# EAGLE design P32 Main (EAGLE 5.06)
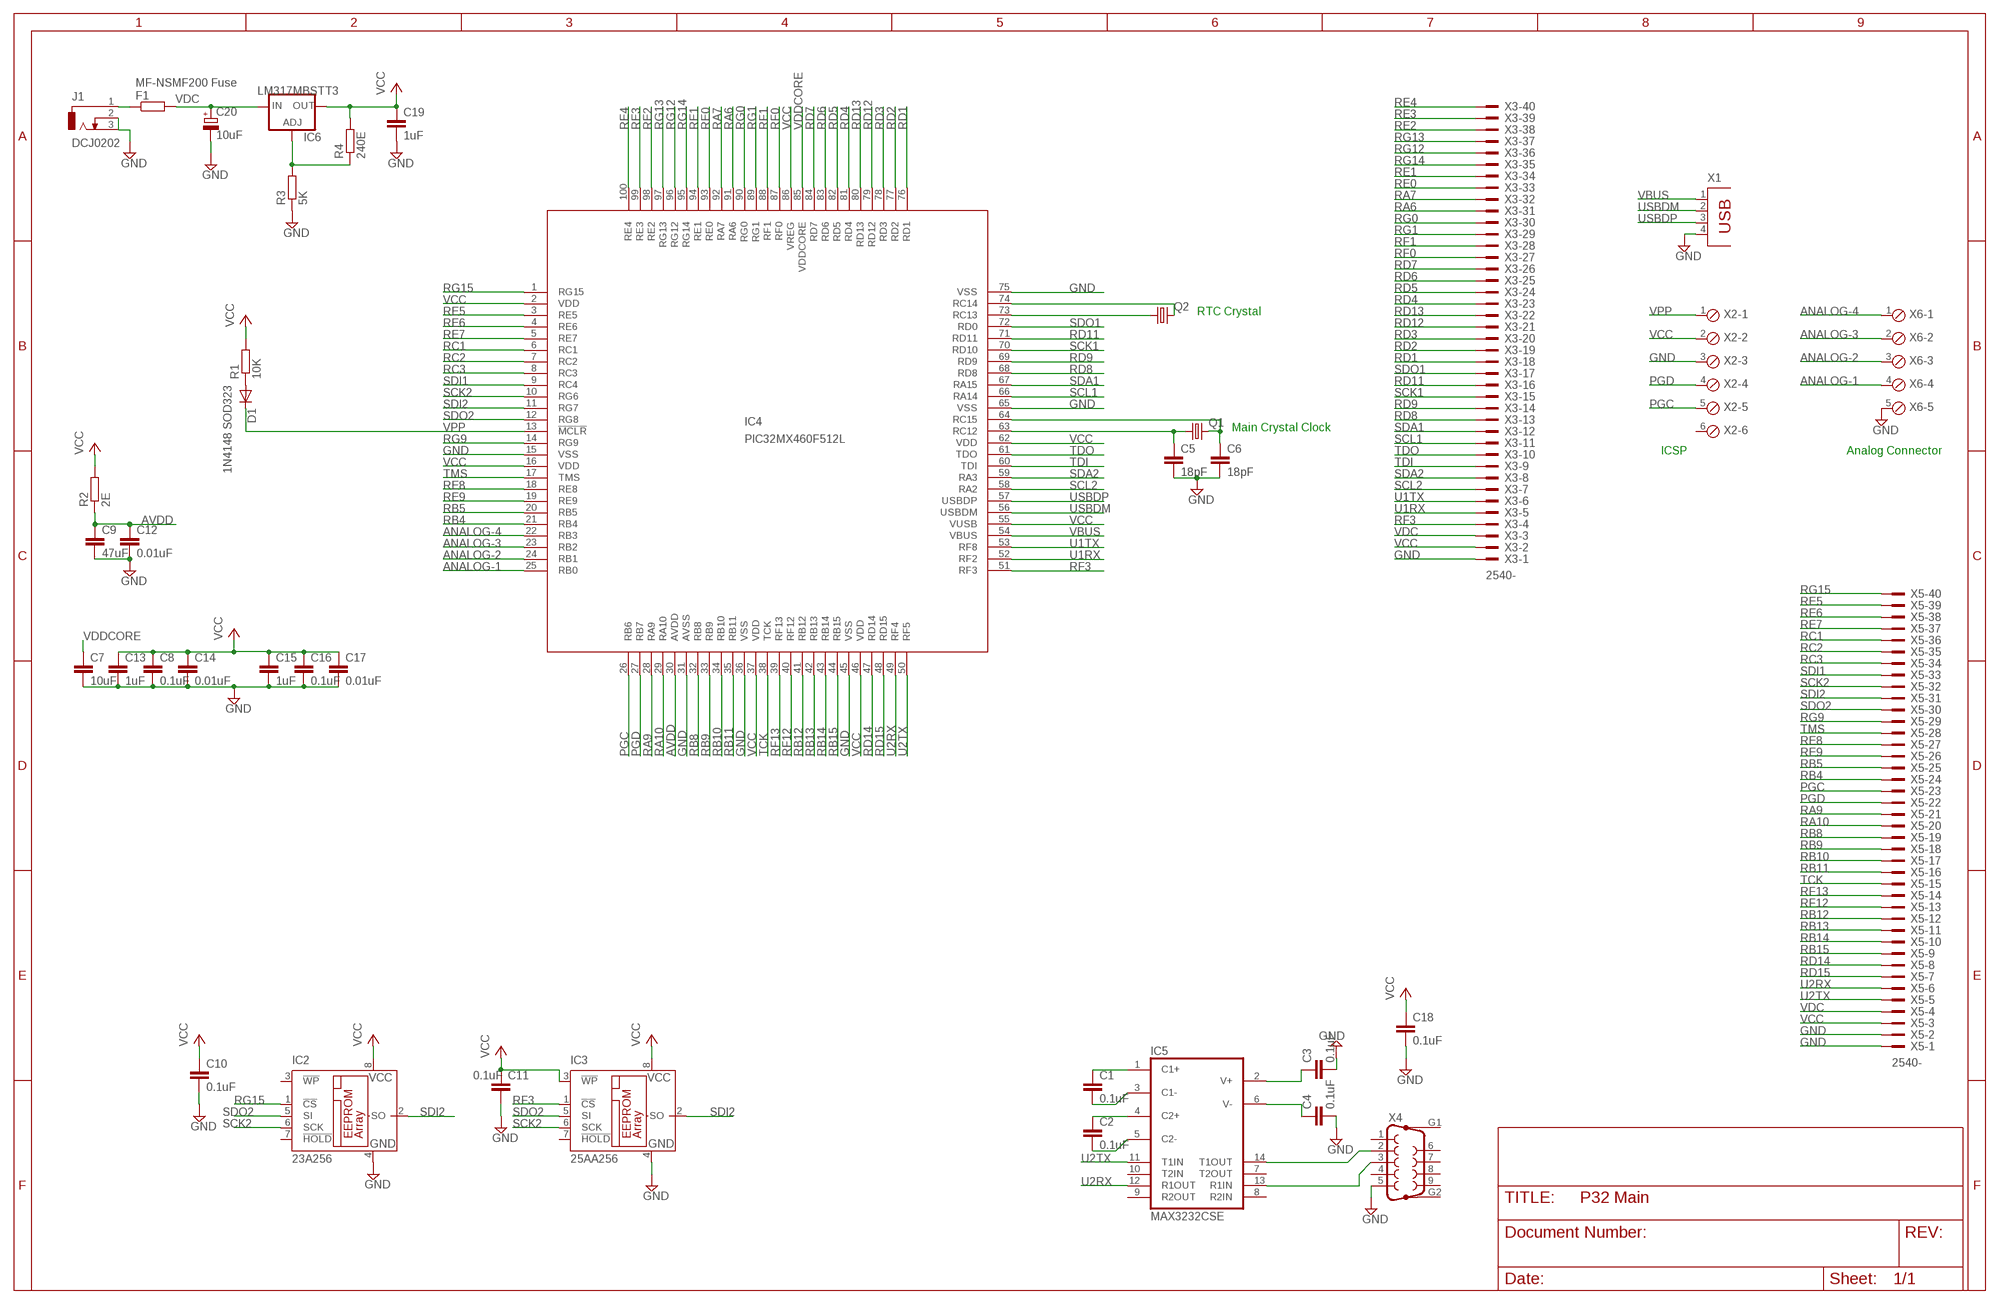
[diagram p0: schematic, sheet 1]

## Parts
C1  0.1uF  C-EUC0805  [C0805]
C2  0.1uF  C-EUC0805  [C0805]
C3  0.1uF  C-EUC0805  [C0805]
C4  0.1uF  C-EUC0805  [C0805]
C5  18pF  C-EUC0805  [C0805]
C6  18pF  C-EUC0805  [C0805]
C7  10uF  C-EUC0805  [C0805]
C8  0.1uF  C-EUC0805  [C0805]
C9  47uF  C-EUC1206  [C1206]
C10  0.1uF  C-EUC0805  [C0805]
C11  0.1uF  C-EUC0805  [C0805]
C12  0.01uF  C-EUC0805  [C0805]
C13  1uF  C-EUC0805  [C0805]
C14  0.01uF  C-EUC0805  [C0805]
C15  1uF  C-EUC0805  [C0805]
C16  0.1uF  C-EUC0805  [C0805]
C17  0.01uF  C-EUC0805  [C0805]
C18  0.1uF  C-EUC0805  [C0805]
C19  1uF  C-EUC0805  [C0805]
C20  10uF  CPOL-EUSMCB  [SMC_B]
D1  1N4148 SOD323  DIODE-SOD323-R  [SOD323-R]
F1  MF-NSMF200 Fuse  R-EU_R1206  [R1206]
IC2  23A256  25AA080SN  [SO-08]
IC3  25AA256  25AA080SN  [SO-08]
IC4  PIC32MX460F512L  [UBW32_TQFP100]
IC5  MAX3232CSE  [SO16]
IC6  LM317MBSTT3  [SOT223]
J1  DCJ0202  [DCJ0202]
Q1  CRYSTALHC49S  [HC49/S]
Q2  CRYSTALTC26V  [TC26V]
R1  10K  R-EU_R0805  [R0805]
R2  2E  R-EU_R0805  [R0805]
R3  5K  R-EU_R0805  [R0805]
R4  240E  R-EU_R0805  [R0805]
X1  PN61729  [PN61729]
X2  MPT6  [6POL254]
X3  2540-  [PAK100/2500-40]
X4  F09HP  [F09HP]
X5  2540-  [PAK100/2500-40]
X6  MPT5  [5POL254]

## Nets
ANALOG-1: IC4.25(RB0) X6.4
ANALOG-2: IC4.24(RB1) X6.3
ANALOG-3: IC4.23(RB2) X6.2
ANALOG-4: IC4.22(RB3) X6.1
AVDD: C9.1 C12.1 IC4.30(AVDD) R2.1
GND: C3.2 C4.2 C5.2 C6.2 C7.2 C8.2 C9.2 C10.2 C11.2 C12.2 C13.2 C14.2 C15.2 C16.2 C17.2 C18.2 C19.2 C20.- IC2.4(GND) IC3.4(GND) IC4.15(VSS) IC4.31(AVSS) IC4.36(VSS) IC4.45(VSS) IC4.65(VSS) IC4.75(VSS) J1.2 J1.3 R3.1 X1.4 X2.3 X3.1 X4.5 X5.1 X5.2 X6.5
N$1: D1.A R1.1
N$2: C3.1 IC5.2(V+)
N$5: C4.1 IC5.6(V-)
N$6: C1.1 IC5.1(C1+)
N$7: C1.2 IC5.3(C1-)
N$9: C2.1 IC5.4(C2+)
N$10: C2.2 IC5.5(C2-)
N$12: IC6.1(ADJ) R3.2 R4.1
N$13: IC5.14(T1OUT) X4.2
N$14: IC5.13(R1IN) X4.3
N$17: F1.1 J1.1
N$90: IC4.74(RC14) Q2.2
N$91: IC4.73(RC13) Q2.1
N$100: C6.1 IC4.64(RC15) Q1.2
N$101: C5.1 IC4.63(RC12) Q1.1
PGC: IC4.26(RB6) X2.5 X5.23
PGD: IC4.27(RB7) X2.4 X5.22
RA6: IC4.91(RA6) X3.31
RA7: IC4.92(RA7) X3.32
RA9: IC4.28(RA9) X5.21
RA10: IC4.29(RA10) X5.20
RB4: IC4.21(RB4) X5.24
RB5: IC4.20(RB5) X5.25
RB8: IC4.32(RB8) X5.19
RB9: IC4.33(RB9) X5.18
RB10: IC4.34(RB10) X5.17
RB11: IC4.35(RB11) X5.16
RB12: IC4.41(RB12) X5.12
RB13: IC4.42(RB13) X5.11
RB14: IC4.43(RB14) X5.10
RB15: IC4.44(RB15) X5.9
RC1: IC4.6(RC1) X5.36
RC2: IC4.7(RC2) X5.35
RC3: IC4.8(RC3) X5.34
RD1: IC4.76(RD1) X3.18
RD2: IC4.77(RD2) X3.19
RD3: IC4.78(RD3) X3.20
RD4: IC4.81(RD4) X3.23
RD5: IC4.82(RD5) X3.24
RD6: IC4.83(RD6) X3.25
RD7: IC4.84(RD7) X3.26
RD8: IC4.68(RD8) X3.13
RD9: IC4.69(RD9) X3.14
RD11: IC4.71(RD11) X3.16
RD12: IC4.79(RD12) X3.21
RD13: IC4.80(RD13) X3.22
RD14: IC4.47(RD14) X5.8
RD15: IC4.48(RD15) X5.7
RE0: IC4.93(RE0) X3.33
RE1: IC4.94(RE1) X3.34
RE2: IC4.98(RE2) X3.38
RE3: IC4.99(RE3) X3.39
RE4: IC4.100(RE4) X3.40
RE5: IC4.3(RE5) X5.39
RE6: IC4.4(RE6) X5.38
RE7: IC4.5(RE7) X5.37
RE8: IC4.18(RE8) X5.27
RE9: IC4.19(RE9) X5.26
RF0: IC4.87(RF0) X3.27
RF1: IC4.88(RF1) X3.28
RF3: IC3.1(!CS) IC4.51(RF3) X3.4
RF12: IC4.40(RF12) X5.13
RF13: IC4.39(RF13) X5.14
RG0: IC4.90(RG0) X3.30
RG1: IC4.89(RG1) X3.29
RG9: IC4.14(RG9) X5.29
RG12: IC4.96(RG12) X3.36
RG13: IC4.97(RG13) X3.37
RG14: IC4.95(RG14) X3.35
RG15: IC2.1(!CS) IC4.1(RG15) X5.40
SCK1: IC4.70(RD10) X3.15
SCK2: IC2.6(SCK) IC3.6(SCK) IC4.10(RG6) X5.32
SCL1: IC4.66(RA14) X3.11
SCL2: IC4.58(RA2) X3.7
SDA1: IC4.67(RA15) X3.12
SDA2: IC4.59(RA3) X3.8
SDI1: IC4.9(RC4) X5.33
SDI2: IC2.2(SO) IC3.2(SO) IC4.11(RG7) X5.31
SDO1: IC4.72(RD0) X3.17
SDO2: IC2.5(SI) IC3.5(SI) IC4.12(RG8) X5.30
TCK: IC4.38(TCK) X5.15
TDI: IC4.60(TDI) X3.9
TDO: IC4.61(TDO) X3.10
TMS: IC4.17(TMS) X5.28
U1RX: IC4.52(RF2) X3.5
U1TX: IC4.53(RF8) X3.6
U2RX: IC4.49(RF4) IC5.12(R1OUT) X5.6
U2TX: IC4.50(RF5) IC5.11(T1IN) X5.5
USBDM: IC4.56(USBDM) X1.2
USBDP: IC4.57(USBDP) X1.3
VBUS: IC4.54(VBUS) X1.1
VCC: C8.1 C10.1 C11.1 C13.1 C14.1 C15.1 C16.1 C17.1 C18.1 C19.1 IC2.8(VCC) IC3.3(!WP) IC3.8(VCC) IC4.2(VDD) IC4.16(VDD) IC4.37(VDD) IC4.46(VDD) IC4.55(VUSB) IC4.62(VDD) IC4.86(VREG) IC6.4(OUT) R1.2 R2.2 R4.2 X2.2 X3.2 X5.3
VDC: C20.+ F1.2 IC6.3(IN) X3.3 X5.4
VDDCORE: C7.1 IC4.85(VDDCORE)
VPP: D1.C IC4.13(!MCLR) X2.1
Unconnected: IC2.3(!WP) IC2.7(!HOLD) IC3.7(!HOLD) IC5.7(T2OUT) IC5.8(R2IN) IC5.9(R2OUT) IC5.10(T2IN) X2.6 X4.1 X4.4 X4.6 X4.7 X4.8 X4.9 X4.G1 X4.G2

## Notes on the sheet
- RTC Crystal
- Main Crystal Clock
- ICSP | Analog Connector

## Power pins joined to a net without a drawn wire
GND: IC5.15(GND)
VCC: IC5.16(VCC)

## Library data of the parts
C1-C19 = rcl:C-EU: CAPACITOR, European symbol
C20 = rcl:CPOL-EU: POLARIZED CAPACITOR, European symbol
D1 = diode:DIODE-: DIODE
F1 R1-R4 = rcl:R-EU_: RESISTOR, European symbol
IC2 IC3 = microchip:25*: Serial EEPROM 4 K, SPI bus
IC4 = microchip:PIC32MX460F512L: PIC32MX460F512L edit this description Auto generated by make-symbol-device-package-bsdl.ulp Rev. 25 Source: PIC32MX460F512L.bsdl
IC5 = maxim:MAX3232*: True RS-232 Transceivers 3.0V to 5.5V, Low-Power up to 1Mbps, Using Four 0.1µF External Capacitors Source: http://pdfserv.maxim-ic.com/en/ds/MAX3222-MAX3241.pdf
IC6 = v-reg:LM317?*: 500 mA Adjustable Output Positive Voltage Regulator Source: http://www.onsemi.co.jp .. LM317M-D.PDF
J1 = con-jack:DCJ0202: DC POWER JACK Source: DCJ0202.pdf
Q1 Q2 = crystal:CRYSTAL: CRYSTAL
X1 = con-berg:PN61729: BERG USB connector
X2 = con-phoenix-254:MPT6: PHOENIX CONNECTOR
X3 X5 = con-3m:2540-: 3M (TM) Pak 100 4-Wall Header Source: 3M
X4 = con-subd:F09HP: SUB-D
X6 = con-phoenix-254:MPT5: PHOENIX CONNECTOR

## Board
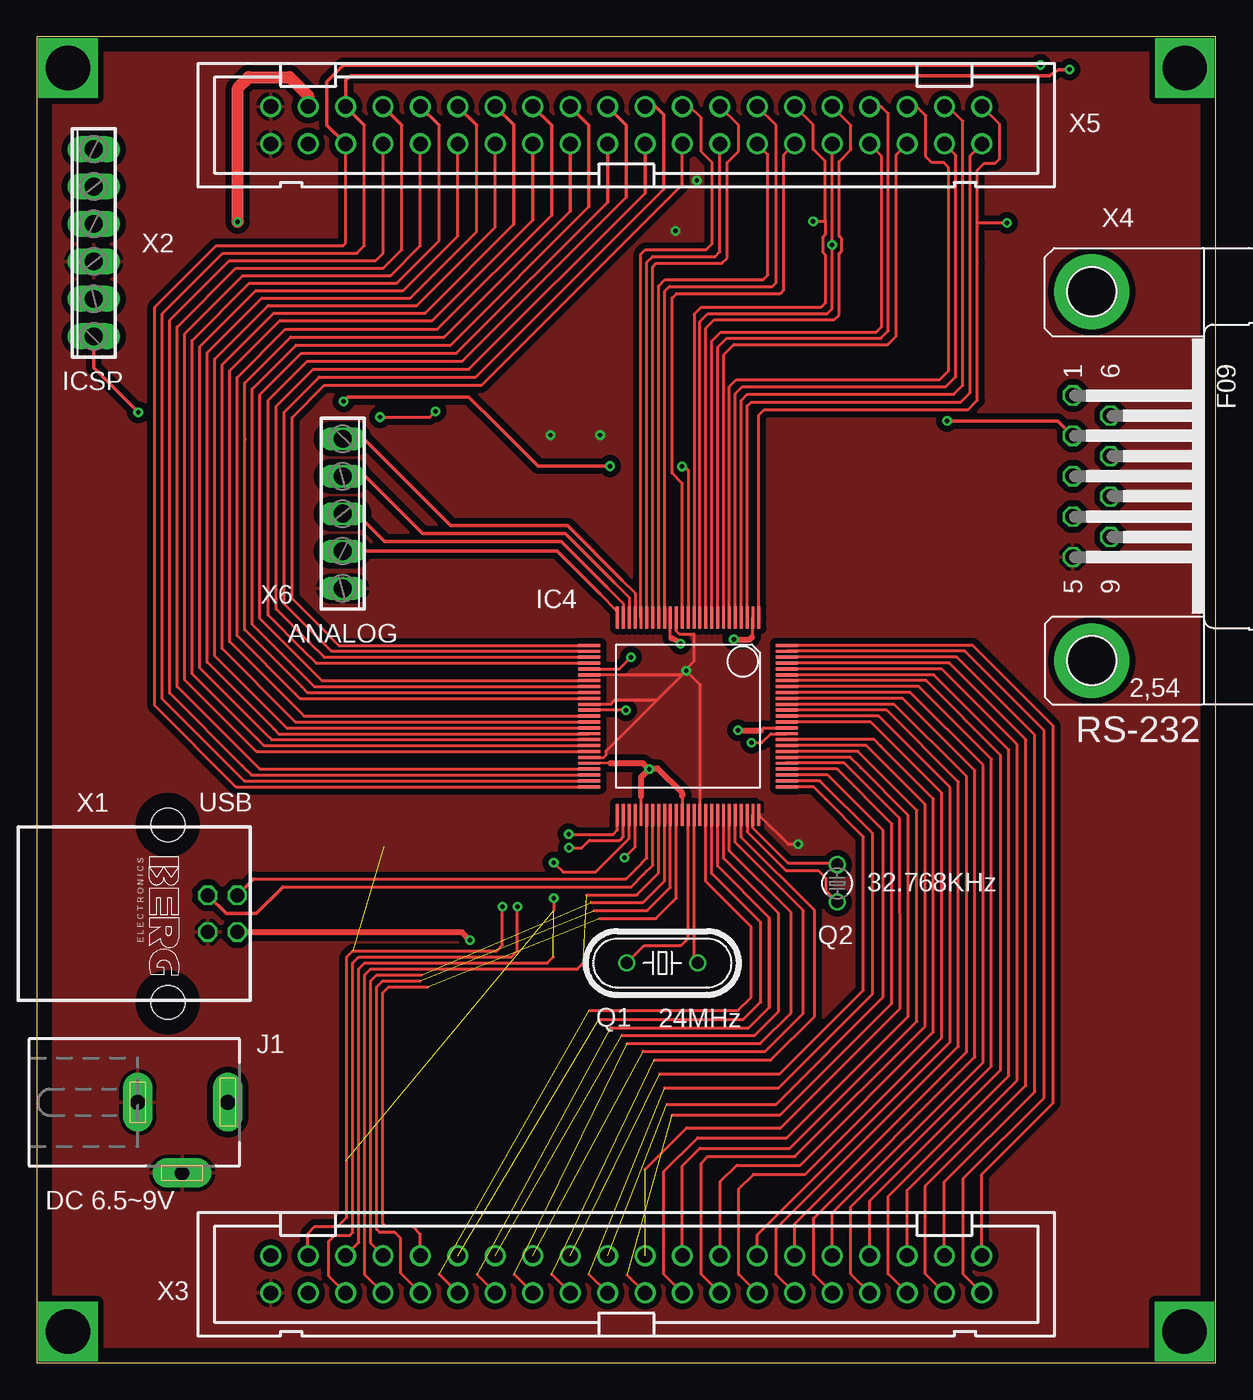
[diagram p1: board, top side]
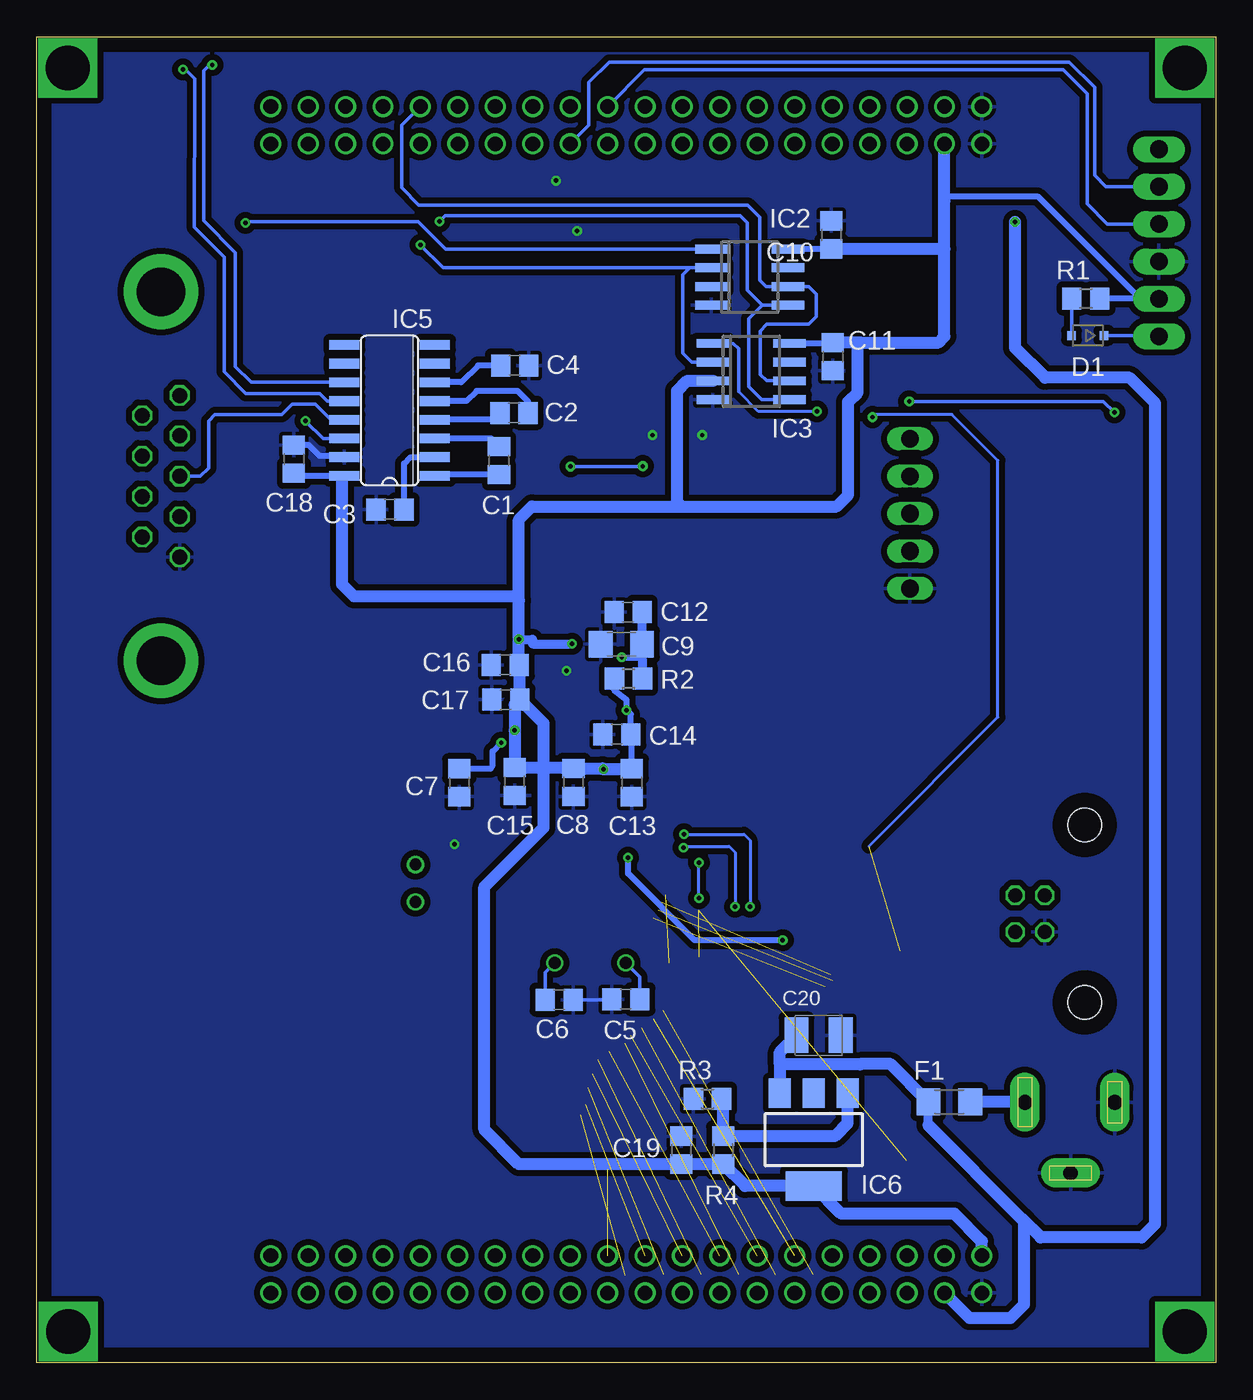
[diagram p2: board, bottom side, seen from below]

Size 80 x 90 mm. Coordinates in mm from the lower left corner, seen from the top.
Outline: 0,0 80,0 80,90 0,90 0,0
Copper layers (1*16): Top 0.035mm / dielectric 1.5mm / Bottom 0.035mm
Design rules "default *": minimum track width 7mil, minimum drill 0.3mm, track to track 7mil, track to pad 7mil, pad to pad 7mil, via to via 8mil, smd to smd 8mil, copper to edge 40mil, drill to drill 8mil, minimum pad ring 7mil, minimum via ring 7mil, stop-mask expansion 4mil, vias tented up to drill 0mil, thermal gap 10mil

### Footprints (pad centres in the part's own frame; a part is rotated, then mirrored left to right if it is on the bottom)
C0805 = smd 1.3 x 1.5: 1 -0.95,0; 2 0.95,0
C1206 = smd 1.6 x 1.8: 1 -1.4,0; 2 1.4,0
SMC_B = smd 1.6 x 2.4: + -1.5,0; - 1.5,0
SOD323-R = smd 0.6 x 0.6: A 1.1,0; C -1.1,0
R1206 = smd 1.6 x 1.803: 1 -1.422,0; 2 1.422,0
SO-08 = smd 0.6 x 2.2: 1 -1.905,-2.6; 2 -0.635,-2.6; 3 0.635,-2.6; 4 1.905,-2.6; 5 1.905,2.6; 6 0.635,2.6; 7 -0.635,2.6; 8 -1.905,2.6
UBW32_TQFP100 = smd 0.2 x 1.5: 1 -4.8,-6.7; 2 -4.4,-6.7; 3 -4,-6.7; 4 -3.6,-6.7; 5 -3.2,-6.7; 6 -2.8,-6.7; 7 -2.4,-6.7; 8 -2,-6.7; 9 -1.6,-6.7; 10 -1.2,-6.7; 11 -0.8,-6.7; 12 -0.4,-6.7; 13 0,-6.7; 14 0.4,-6.7; 15 0.8,-6.7; 16 1.2,-6.7; 17 1.6,-6.7; 18 2,-6.7; 19 2.4,-6.7; 20 2.8,-6.7; 21 3.2,-6.7; 22 3.6,-6.7; 23 4,-6.7; 24 4.4,-6.7; 25 4.8,-6.7; 51 4.8,6.7; 52 4.4,6.7; 53 4,6.7; 54 3.6,6.7; 55 3.2,6.7; 56 2.8,6.7; 57 2.4,6.7; 58 2,6.7; 59 1.6,6.7; 60 1.2,6.7; 61 0.8,6.7; 62 0.4,6.7; 63 0,6.7; 64 -0.4,6.7; 65 -0.8,6.7; 66 -1.2,6.7; 67 -1.6,6.7; 68 -2,6.7; 69 -2.4,6.7; 70 -2.8,6.7; 71 -3.2,6.7; 72 -3.6,6.7; 73 -4,6.7; 74 -4.4,6.7; 75 -4.8,6.7 | smd 1.5 x 0.2: 26 6.7,-4.8; 27 6.7,-4.4; 28 6.7,-4; 29 6.7,-3.6; 30 6.7,-3.2; 31 6.7,-2.8; 32 6.7,-2.4; 33 6.7,-2; 34 6.7,-1.6; 35 6.7,-1.2; 36 6.7,-0.8; 37 6.7,-0.4; 38 6.7,0; 39 6.7,0.4; 40 6.7,0.8; 41 6.7,1.2; 42 6.7,1.6; 43 6.7,2; 44 6.7,2.4; 45 6.7,2.8; 46 6.7,3.2; 47 6.7,3.6; 48 6.7,4; 49 6.7,4.4; 50 6.7,4.8; 76 -6.7,4.8; 77 -6.7,4.4; 78 -6.7,4; 79 -6.7,3.6; 80 -6.7,3.2; 81 -6.7,2.8; 82 -6.7,2.4; 83 -6.7,2; 84 -6.7,1.6; 85 -6.7,1.2; 86 -6.7,0.8; 87 -6.7,0.4; 88 -6.7,0; 89 -6.7,-0.4; 90 -6.7,-0.8; 91 -6.7,-1.2; 92 -6.7,-1.6; 93 -6.7,-2; 94 -6.7,-2.4; 95 -6.7,-2.8; 96 -6.7,-3.2; 97 -6.7,-3.6; 98 -6.7,-4; 99 -6.7,-4.4; 100 -6.7,-4.8
SO16 = smd 0.66 x 2.032: 1 -4.445,-3.073; 2 -3.175,-3.073; 3 -1.905,-3.073; 4 -0.635,-3.073; 5 0.635,-3.073; 6 1.905,-3.073; 7 3.175,-3.073; 8 4.445,-3.073; 9 4.445,3.073; 10 3.175,3.073; 11 1.905,3.073; 12 0.635,3.073; 13 -0.635,3.073; 14 -1.905,3.073; 15 -3.175,3.073; 16 -4.445,3.073
SOT223 = smd 1.5 x 2: 1 -2.3,-3.15; 2 0,-3.15; 3 2.3,-3.15 | smd 3.8 x 2: 4 0,3.15
DCJ0202 = drill 1 pad 2 long: 1 0,3.1; 2 4.8,0; 3 0,-3
HC49/S = drill 0.813 round: 1 -2.413,0; 2 2.413,0
TC26V = drill 0.813 round: 1 -1.27,0; 2 1.27,0
R0805 = smd 1.3 x 1.5: 1 -0.95,0; 2 0.95,0
PN61729 = drill 0.95 octagon: 1 1.25,4.71; 2 -1.25,4.71; 3 -1.25,2.71; 4 1.25,2.71 | hole 2.3: -6.02,0; 6.02,0
6POL254 = drill 1.2 pad 1.778 long: 1 -6.35,0; 2 -3.81,0; 3 -1.27,0; 4 1.27,0; 5 3.81,0; 6 6.35,0
PAK100/2500-40 = drill 1 pad 1.422 round: 1 -24.13,-1.27; 2 -24.13,1.27; 3 -21.59,-1.27; 4 -21.59,1.27; 5 -19.05,-1.27; 6 -19.05,1.27; 7 -16.51,-1.27; 8 -16.51,1.27; 9 -13.97,-1.27; 10 -13.97,1.27; 11 -11.43,-1.27; 12 -11.43,1.27; 13 -8.89,-1.27; 14 -8.89,1.27; 15 -6.35,-1.27; 16 -6.35,1.27; 17 -3.81,-1.27; 18 -3.81,1.27; 19 -1.27,-1.27; 20 -1.27,1.27; 21 1.27,-1.27; 22 1.27,1.27; 23 3.81,-1.27; 24 3.81,1.27; 25 6.35,-1.27; 26 6.35,1.27; 27 8.89,-1.27; 28 8.89,1.27; 29 11.43,-1.27; 30 11.43,1.27; 31 13.97,-1.27; 32 13.97,1.27; 33 16.51,-1.27; 34 16.51,1.27; 35 19.05,-1.27; 36 19.05,1.27; 37 21.59,-1.27; 38 21.59,1.27; 39 24.13,-1.27; 40 24.13,1.27
F09HP = drill 1.016 octagon: 1 -5.486,-1.27; 2 -2.743,-1.27; 3 0,-1.27; 4 2.743,-1.27; 5 5.486,-1.27; 6 -4.115,1.27; 7 -1.372,1.27; 8 1.372,1.27; 9 4.115,1.27 | drill 3.302 pad 5.08 round: G1 -12.522,0; G2 12.522,0
5POL254 = drill 1.2 long: 1 -5.08,0; 2 -2.54,0; 3 0,0; 4 2.54,0; 5 5.08,0

### Placement (x,y rotation side)
C1  48.64,61.24 90 bottom
C2  47.62,64.47 0 bottom
C3  56.03,57.91 180 bottom
C4  47.57,67.69 0 bottom
C5  40.03,24.66 180 bottom
C6  44.55,24.64 0 bottom
C7  51.33,39.37 270 bottom
C8  43.59,39.4 270 bottom
C9  40.34,48.77 180 bottom
C10  26.09,76.56 90 bottom
C11  25.98,68.3 270 bottom
C12  39.88,50.95 180 bottom
C13  39.62,39.37 270 bottom
C14  40.64,42.65 180 bottom
C15  47.57,39.45 270 bottom
C16  48.21,47.37 180 bottom
C17  48.18,45.01 180 bottom
C18  62.56,61.34 90 bottom
C19  36.27,14.43 90 bottom
C20  26.95,22.23 0 bottom
D1  8.69,69.72 180 bottom
F1  18.08,17.7 180 bottom
IC2  31.62,73.69 270 bottom
IC3  31.52,67.28 270 bottom
IC4  44.2,43.89 180 top
IC5  56.06,64.64 90 bottom
IC6  27.28,15.14 180 bottom
J1  9.86,17.68 270 top
Q1  42.44,27.13 0 top
Q2  54.31,32.54 90 top
R1  8.81,72.24 0 bottom
R2  39.85,46.43 180 bottom
R3  34.49,17.91 0 bottom
R4  33.43,14.43 270 bottom
X1  8.89,30.48 270 top
X2  3.86,76.02 90 top
X3  40,6 0 top
X4  71.58,60.17 270 top
X5  40,84 0 top
X6  20.75,57.63 270 top

### Tracks (layer width: path | path; a pad name or v marks a point on that pad's centre or on a via)
ANALOG-1
  Top 0.203: 38.2,52.2 39.4,51 IC4.25
  Top 0.254: X6.4 35.31,55.09 38.2,52.2
ANALOG-2
  Top 0.203: 38.7,52.62 39.8,51.52 IC4.24
  Top 0.254: X6.3 21.69,57.63 23.6,55.73 35.59,55.73 38.7,52.62
ANALOG-3
  Top 0.203: 39.2,52.95 40.2,51.95 IC4.23
  Top 0.254: 39.2,52.95 35.87,56.29 26.19,56.29 22.3,60.17 X6.2
ANALOG-4
  Top 0.203: 39.7,53.14 40.6,52.24 IC4.22
  Top 0.254: 39.7,53.14 36.02,56.82 28.09,56.82 22.2,62.71 X6.1
AVDD  (via drill 0.3)
  Top 0.203: IC4.30 39.52,47.09 v40.31,47.88
  Top 0.254: v40.31,47.88 40.3,47.89
  Bottom 0.406: v40.31,47.88 39.06,47.88 38.94,47.75
  Bottom 0.61: R2.1 38.94,46.43 38.94,47.75 C9.1 38.93,48.77 C12.1
GND  (via drill 0.3)
  Top 0.203: IC4.31 43.8,46.69 v44.07,46.97 | IC4.36 38.95,44.69 39.19,44.93 42.04,44.93 v44.07,46.97 | IC4.45 38.48,41.09 38.63,41.25 38.63,41.53 v44.07,46.97 | IC4.15 43.4,49.67 43.64,49.43 44.58,49.43 44.6,49.4 44.6,47.62 43.97,46.99 44.07,46.99 44.09,46.97 | IC4.65 45,46.04 v44.07,46.97 | IC4.75 50.98,35.2 v51.66,35.2
  Bottom 0.254: C6.2 41.01,24.64 C5.2
  Bottom 0.406: C18.2 61.55,62.29 60.81,61.54 59.21,61.54 IC5.15
  other vias: 34.85,62.97 38.23,62.97 43.33,76.83 44.78,80.24
  pour Top (isolate 0.406): 0.43,89.53 79.76,89.53 79.76,0.25 0.43,0.25
  pour Bottom (isolate 0.406): 0.25,89.74 79.76,89.74 79.76,0.2 0.25,0.2
N$1
  Bottom 0.254: R1.1 9.76,69.75 D1.A
N$2
  Bottom 0.406: C3.1 55.08,61.05 54.66,61.47 IC5.2
N$3  (via drill 3)
  other vias: 2.11,87.88
N$4  (via drill 3)
  other vias: 77.9,87.88
N$5
  Bottom 0.406: IC5.6 51.21,66.55 50.06,67.69 C4.1
N$6
  Bottom 0.406: C1.1 52.89,60.29 IC5.1
N$7
  Bottom 0.406: C1.2 49.19,62.74 IC5.3
N$8  (via drill 3)
  other vias: 77.88,2.11
N$9
  Bottom 0.406: C2.1 49.03,64.01 IC5.4
N$10
  Bottom 0.406: IC5.5 50.85,65.28 50.16,65.96 47.37,65.96 46.67,65.27 C2.2
N$11  (via drill 3)
  other vias: 2.11,2.11
N$12
  Bottom 0.61: 33.43,17.79 R3.2
  Bottom 0.813: 33.43,17.79 R4.1 25.87,15.38 24.98,16.27 IC6.1
N$13  (via drill 0.3)
  Top 0.254: v61.77,63.93 69.29,63.93 X4.2
  Bottom 0.254: IC5.14 60.58,62.74 v61.77,63.93
N$14
  Bottom 0.254: IC5.13 60.05,64.01 61.11,65.08 62.66,65.08 63.37,64.36 67.92,64.36 68.35,63.93 68.35,60.73 68.91,60.17 X4.3
N$17
  Bottom 0.61: J1.1 12.98,17.7
  Bottom 0.813: 12.98,17.7 F1.1
N$90
  Top 0.203: 54.18,33.93 50.95,33.93 49.7,35.19 48.6,36.29 IC4.74
  Top 0.254: 54.18,33.93 Q2.2
N$91
  Top 0.203: Q2.1 53.52,32.05 53.52,32.92 53.03,33.4 50.83,33.4 48.2,36.03 IC4.73
N$100
  Top 0.203: IC4.64 44.6,27.39 Q1.2
  Bottom 0.254: C6.1 45.5,26.48 Q1.2
N$101
  Top 0.203: Q1.1 41.22,28.32 43.71,28.32 44.2,28.8 IC4.63
  Bottom 0.254: C5.1 39.08,26.18 Q1.1
PGC
  Top 0.203: X5.23 43.81,79.98 30.18,66.34 19.51,66.34 17.32,64.16 17.32,51.87 19.25,49.94 20.5,48.69 IC4.26
  Bottom 0.254: X2.5 7.47,79.83 8.23,80.59 8.23,86.59 9.93,88.29 41.17,88.29 42.55,86.92 42.55,84 X5.23
PGD
  Top 0.203: 42.55,79.65 29.79,66.9 19.15,66.9 16.79,64.54 16.79,51.49 18.88,49.39 19.98,48.29 IC4.27
  Top 0.254: X5.22 41.98,85.27 42.55,84.71 42.55,79.65
  Bottom 0.254: X2.4 7.37,77.29 8.74,78.66 8.74,86.13 10.36,87.76 38.78,87.76 X5.22
RA6
  Top 0.203: X3.31 52.7,6 52.7,9.8 63.65,20.75 63.65,40.18 58.74,45.09 IC4.91
RA7
  Top 0.203: X3.32 53.98,10.16 64.21,20.4 64.21,40.56 59.28,45.49 IC4.92
RA9
  Top 0.203: 41.27,79.39 29.31,67.44 18.75,67.44 16.23,64.92 16.23,51.16 18.5,48.89 19.5,47.89 IC4.28
  Top 0.254: 41.27,79.39 X5.21
RA10
  Top 0.203: 40.01,79.12 28.85,67.97 18.34,67.97 15.7,65.33 15.7,50.75 18.05,48.39 18.95,47.49 IC4.29
  Top 0.254: X5.20 40.01,84 40.01,79.12
RB4
  Top 0.203: X5.24 44.32,85.27 45.09,84.51 45.09,82.19 45.82,81.46 45.82,75.95 45.41,75.54 41.3,75.54 41,75.23 IC4.21
RB5
  Top 0.203: X5.25 46.35,75.41 46.02,75.08 41.78,75.08 41.4,74.69 IC4.20
RB8
  Top 0.203: 38.73,78.79 28.47,68.53 17.96,68.53 15.11,65.71 15.11,50.52 19.34,46.29 IC4.32
  Top 0.254: 38.73,78.79 X5.19
RB9
  Top 0.203: 37.47,78.46 28.09,69.09 17.6,69.09 14.61,66.09 14.61,50.11 18.33,46.39 18.83,45.89 IC4.33
  Top 0.254: X5.18 37.47,84 37.47,78.46
RB10
  Top 0.203: 36.19,78.18 27.64,69.62 17.22,69.62 14.1,66.5 14.1,62.69 14.1,49.76 17.96,45.89 18.36,45.49 IC4.34
  Top 0.254: 36.19,78.18 X5.17 | 14.1,62.69 14.1,62.64
RB11
  Top 0.203: 34.92,77.9 27.18,70.16 16.87,70.16 13.59,66.88 13.59,49.35 17.55,45.39 17.85,45.09 IC4.35
  Top 0.254: X5.16 34.92,84 34.92,77.9
RB12
  Top 0.203: 29.84,84 29.84,76.76 25.35,72.26 15.27,72.26 11.56,68.56 11.56,47.55 16.07,43.04 16.41,42.69 IC4.41
  Top 0.254: 29.84,84 X5.12
RB13
  Top 0.203: X5.11 28.57,76.47 24.87,72.77 14.86,72.77 11.05,68.96 11.05,47.17 15.53,42.69 15.93,42.29 IC4.42
RB14
  Top 0.203: 27.3,84 27.3,76.17 24.41,73.28 14.43,73.28 10.54,69.39 10.54,46.76 14.92,42.38 15.41,41.89 IC4.43
  Top 0.254: 27.3,84 X5.10
RB15
  Top 0.203: X5.9 26.03,75.81 24,73.79 13.97,73.79 10.03,69.85 10.03,46.35 14.9,41.49 IC4.44
RC1
  Top 0.203: X5.36 59.71,85.27 60.33,84.66 60.33,81.86 60.73,81.46 61.54,81.46 61.87,81.13 61.87,67.33 61.27,66.73 47.47,66.73 47,66.25 IC4.6
RC2
  Top 0.203: X5.35 58.32,82 58.32,69.7 57.73,69.11 47.3,69.11 46.6,68.42 IC4.7
RC3
  Top 0.203: X5.34 57.3,85.27 57.78,84.78 57.78,70.05 57.28,69.55 46.81,69.55 46.2,68.93 IC4.8
RD1  (1 unrouted)
  Top 0.203: 42.27,19.61 50.42,19.61 56.08,25.27 56.08,35.69 53.52,38.25 53.52,38.28 52.7,39.09 IC4.76
RD2  (1 unrouted)
  Top 0.203: X3.19 37.47,6 | 42.6,18.67 50.34,18.67 56.72,25.04 56.72,35.92 53.14,39.49 IC4.77
RD3  (1 unrouted)
  Top 0.203: 42.75,17.55 50.16,17.55 57.43,24.82 57.43,36.14 53.68,39.89 IC4.78
RD4
  Top 0.203: X3.23 42.55,6 42.55,12.98 44.83,15.27 50.9,15.27 59.13,23.5 59.13,37.16 55.9,40.39 55.2,41.09 IC4.81
RD5
  Top 0.203: X3.24 43.79,7.29 43.79,13.36 44.98,14.55 51.1,14.55 59.72,23.16 59.72,37.49 56.31,40.89 55.72,41.49 IC4.82
RD6
  Top 0.203: X3.25 45.09,6 45.09,13.54 45.54,13.99 51.44,13.99 60.27,22.84 60.27,37.9 56.78,41.39 56.28,41.89 IC4.83
RD7
  Top 0.203: X3.26 46.38,7.3 46.38,12.29 47.5,13.41 51.79,13.41 60.83,22.45 60.83,38.28 57.3,41.81 | 57.3,41.81 57.22,41.89 | IC4.84 56.82,42.29 57.3,41.81
RD8  (1 unrouted)
  Top 0.203: X3.13 29.87,5.97 | 49.71,24.13 48.31,22.73 38.94,22.73 | IC4.68 46.2,33.71 49.71,30.2
  Top 0.254: 49.71,24.13 49.71,30.2
RD9  (1 unrouted)
  Top 0.203: 39.7,22.23 48.72,22.23 50.34,23.85 50.34,30.48 46.6,34.23 IC4.69
RD11  (1 unrouted)
  Top 0.203: 41.15,21.13 49.43,21.13 52.02,23.72 52.02,30.68 47.4,35.31 IC4.71
RD12  (1 unrouted)
  Top 0.203: X3.21 40.06,5.94 | 43.1,16.82 50.44,16.82 58.01,24.38 58.01,36.58 54.3,40.29 IC4.79
RD13  (1 unrouted)
  Top 0.203: 41.27,13.13 44.09,15.95 50.47,15.95 58.57,24.05 58.55,36.93 54.79,40.69 IC4.80
RD14
  Top 0.203: 24.77,84 24.77,75.54 23.52,74.3 13.51,74.3 9.53,70.31 9.53,45.9 14.24,41.19 15.13,40.29 IC4.47
  Top 0.254: 24.77,84 X5.8
RD15
  Top 0.203: X5.7 23.49,75.31 22.99,74.8 13.06,74.8 9.02,70.76 9.02,45.49 9.02,45.45 13.99,40.48 14.58,39.89 IC4.48
RE0
  Top 0.203: X3.33 55.24,6 55.24,10.59 64.77,20.12 64.77,40.97 59.85,45.89 IC4.93
RE1
  Top 0.203: X3.34 56.52,10.97 65.41,19.86 65.41,41.22 60.34,46.29 IC4.94
RE2
  Top 0.203: X3.38 61.59,12.26 67.72,18.39 67.72,42.6 62.42,47.89 IC4.98
RE3
  Top 0.203: X3.39 62.87,6 62.87,12.5 68.35,17.98 68.35,42.9 62.96,48.29 IC4.99
RE4
  Top 0.203: X3.40 64.13,12.8 68.96,17.63 68.96,43.23 63.5,48.69 IC4.100
RE5
  Top 0.203: X5.39 63.32,81.92 63.32,65.84 62.69,65.2 48.46,65.2 48.2,64.94 IC4.3
RE6
  Top 0.203: X5.38 61.85,85.27 62.84,84.28 62.84,66.34 62.23,65.73 48.21,65.73 47.8,65.32 IC4.4
RE7
  Top 0.203: X5.37 62.36,81.96 62.36,66.93 61.67,66.24 47.85,66.24 47.4,65.79 IC4.5
RE8
  Top 0.203: IC4.18 42.2,73.08 42.62,73.51 49.28,73.51 49.61,73.84 49.61,82.01 X5.27
RE9
  Top 0.203: X5.26 47.62,84 47.62,82.25 46.84,81.46 46.84,74.98 46.48,74.62 42.01,74.62 41.8,74.41 IC4.19
RF0
  Top 0.203: X3.27 47.62,6 47.62,11.79 48.64,12.8 52.15,12.8 61.39,22.05 61.39,38.68 56.59,43.49 IC4.87
RF1
  Top 0.203: X3.28 48.89,8.68 61.98,21.77 61.98,39.04 57.12,43.89 IC4.88
RF3  (via drill 0.3)  (1 unrouted)
  Top 0.203: v27.05,64.57 26.67,64.19 v23.29,64.19 | X3.4 18.39,7.29 18.39,8.76 18.87,9.25 20.42,9.25 21.03,9.86 21.03,27.53 21.44,27.94 31.19,27.94 31.6,28.35 v31.6,30.96 | IC4.51 39.4,36.15 39.12,35.87 v36.09,35.87
  Bottom 0.203: 32.38,65.91 31.04,64.57 v27.05,64.57 | v23.29,64.19 23.11,64.36 17.91,64.36 14.78,61.24 14.78,43.81 23.55,35.05 | v36.09,35.87 32,35.87 31.6,35.46 v31.6,30.96
  Bottom 0.254: IC3.1 32.74,69.19 32.38,68.83 32.38,65.91
RF12
  Top 0.203: X5.13 31.11,77.08 25.78,71.75 15.7,71.75 12.06,68.12 12.06,47.98 16.6,43.45 16.95,43.09 IC4.40
RF13
  Top 0.203: 32.36,77.27 26.34,71.25 16.08,71.25 12.57,67.74 12.57,48.46 17.31,43.73 17.55,43.49 IC4.39
  Top 0.254: X5.14 32.36,84.02 32.36,77.27
RG0
  Top 0.203: X3.30 51.43,9.42 63.09,21.08 63.09,39.78 58.18,44.69 IC4.90
RG1
  Top 0.203: X3.29 50.19,5.97 50.19,9.12 62.53,21.46 62.53,39.42 57.66,44.29 IC4.89
RG9
  Top 0.203: IC4.14 43.8,59.68 43.1,60.38 43.1,72.26 43.41,72.57 50.44,72.57 50.7,72.82 50.7,82 X5.29
RG12
  Top 0.203: X3.36 59.05,9.25 59.05,11.71 66.52,19.18 66.52,41.96 61.39,47.09 IC4.96
RG13
  Top 0.203: X3.37 60.3,6.02 60.3,12.01 67.11,18.82 67.11,42.29 61.91,47.49 IC4.97
RG14
  Top 0.203: X3.35 57.76,6.02 57.76,11.28 65.96,19.48 65.96,41.6 60.88,46.69 IC4.95
RG15  (via drill 0.3)
  Top 0.203: X5.40 65.33,84.07 65.33,81.71 65.02,81.41 64.29,81.41 63.83,80.95 63.83,77.11 | 63.83,77.11 63.83,74.65 63.83,65.33 63.2,64.69 49.35,64.69 49,64.34 IC4.1 | v65.84,77.37 63.83,77.37 63.83,77.11
  Bottom 0.254: IC2.1 52.25,75.59 54.1,77.44 65.76,77.44 v65.84,77.37
SCK1  (1 unrouted)
  Top 0.203: X3.15 32.38,6 | 40.06,21.67 49.1,21.67 51.18,23.75 51.18,30.56 47,34.74 IC4.70
SCK2
  Top 0.203: X5.32 55.24,84 55.24,82.35 54.43,81.53 54.43,76.45 54.63,76.25 54.63,75.49 54.43,75.29 54.43,71.12 54.1,70.79 45.97,70.79 45.4,70.21 IC4.10
  Bottom 0.254: X5.32 55.24,84 55.24,79.76 54.08,78.59 31.77,78.59 30.94,77.75 30.94,73.48 30.5,73.05 IC2.6 27.61,73.05 27.1,72.54 27.1,70.99 27.61,70.48 30.45,70.48 30.91,70.03 30.91,67.08 30.48,66.65 IC3.6
SCL1  (1 unrouted)
  Top 0.203: X3.11 27.3,6 | 37.49,23.9 47.57,23.9 48.46,24.79 48.46,29.59 45.4,32.66 IC4.66
SCL2  (1 unrouted)
  Top 0.203: 37.31,31.75 40.72,31.75 42.2,33.23 IC4.58 | X3.7 22.25,5.97 22.25,26.31 22.66,26.72 36.68,26.72 37.08,27.13
SDA1  (1 unrouted)
  Top 0.203: 38.12,23.29 47.93,23.29 49.12,24.49 49.12,29.87 45.8,33.2 IC4.67
SDA2  (1 unrouted)
  Top 0.203: 37.62,31.24 41.15,31.24 42.6,32.69 IC4.59 | X3.8 22.66,8.1 22.66,25.91 23.06,26.31 26.11,26.31
SDI1
  Top 0.203: IC4.9 45.8,69.34 46.41,69.95 56.95,69.95 57.33,70.33 57.33,81.91 X5.33
SDI2  (via drill 0.3)
  Top 0.203: X5.31 v53.97,75.87 53.97,71.55 53.62,71.2 45.54,71.2 45,70.65 IC4.11
  Bottom 0.254: v53.97,75.87 52.42,74.32 IC2.2 35.71,74.32 36.17,73.86 36.17,68.53 35.56,67.92 IC3.2
SDO1  (1 unrouted)
  Top 0.203: X3.17 34.92,6 | 41.91,20.55 49.81,20.55 52.78,23.52 52.78,30.68 47.8,35.67 IC4.72
SDO2  (via drill 0.3)
  Top 0.203: X5.30 52.68,84.02 52.68,82.37 53.49,81.56 53.49,77.5 | 53.49,77.5 53.49,76.56 53.31,76.38 53.31,75.39 53.49,75.21 53.49,71.93 53.19,71.63 45.06,71.63 44.6,71.16 IC4.12 | v52.68,77.47 53.47,77.47 53.49,77.5
  Bottom 0.254: 30.79,71.78 IC2.5 | 30.79,71.78 31.8,72.8 31.8,77.39 32.28,77.88 52.27,77.88 v52.68,77.47 | IC3.5 30.81,65.38 31.7,66.27 31.7,70.87 30.79,71.78
TCK
  Top 0.203: 33.65,77.54 26.85,70.74 16.48,70.74 13.08,67.33 13.08,48.95 18.14,43.89 IC4.38
  Top 0.254: 33.65,77.54 X5.15
TDI  (1 unrouted)
  Top 0.203: 37.82,30.68 41.43,30.68 43,32.25 IC4.60 | X3.9 24.69,6.07 24.69,8.43 24.28,8.84 23.27,8.84 23.06,9.04 23.06,25.5 23.47,25.91 25.98,25.91
TDO  (1 unrouted)
  Top 0.203: 43.17,31.3 42.01,30.15 38.18,30.15 | 43.17,31.3 43.2,31.33 | IC4.61 43.4,31.53 43.17,31.3 | X3.10 26.03,8.72 25.5,9.25 23.67,9.25 23.47,9.45 23.47,25.09 23.88,25.5 26.49,25.5
TMS
  Top 0.203: X5.28 50.16,84 50.16,73.3 49.91,73.05 42.93,73.05 42.6,72.72 IC4.17
U1RX  (via drill 0.3)
  Top 0.203: X3.5 19.81,5.87 19.81,8.23 20.22,8.64 21.23,8.64 21.44,8.84 21.44,27.13 21.84,27.53 32.21,27.53 32.61,27.94 v32.61,30.96 | IC4.52 39.8,35.71 39.54,35.46 37.49,35.46 36.98,34.95 v36.12,34.95
  Bottom 0.203: v36.12,34.95 36.02,35.05 33.02,35.05 32.61,34.65 v32.61,30.96
U1TX  (via drill 0.3)  (2 unrouted)
  Top 0.203: v35.08,33.93 35.71,33.3 37.92,33.3 40.2,35.57 IC4.53 | v35.08,31.52 35.08,30.71 | X3.6 21.84,8.16 21.84,26.72 22.25,27.13 34.65,27.13 35.05,27.53
  Bottom 0.203: v35.08,31.52 v35.08,33.93
U2RX  (via drill 0.3)
  Top 0.203: 22.23,84 22.23,75.82 21.72,75.31 12.62,75.31 8.51,71.2 8.51,45.06 14.08,39.49 IC4.49
  Top 0.254: 22.23,84 X5.6 20.95,87.04 21.29,87.38 68.73,87.38 69.32,87.78 v70.08,87.78
  Bottom 0.254: IC5.12 60.3,65.28 60.81,65.79 65.81,65.79 67.28,67.26 67.28,75.03 69.32,77.06 69.29,86.51 69.29,87.17 69.9,87.78 v70.08,87.78
U2TX  (via drill 0.3)
  Top 0.203: X5.5 20.95,75.99 20.78,75.82 12.17,75.82 8,71.65 8,44.6 13.51,39.09 IC4.50
  Top 0.254: X5.5 19.68,84 19.68,86.97 20.8,88.09 v68.1,88.09
  Bottom 0.254: IC5.11 65.46,66.55 66.52,67.61 66.52,75.36 68.68,77.52 68.68,87.71 68.3,88.09 v68.1,88.09
USBDM
  Top 0.203: 14.71,32.84 39.98,32.84 40.7,33.56 41.4,34.26 IC4.56
  Top 0.254: X1.2 14.71,32.84
USBDP
  Top 0.203: 16.71,32.31 40.34,32.31 41.2,33.17 41.8,33.77 IC4.57
  Top 0.254: 16.71,32.31 14.88,30.48 12.85,30.48 X1.3
VBUS  (via drill 0.3)
  Top 0.203: 39.7,34.47 v39.88,34.29 40.6,35.01 IC4.54
  Top 0.406: X1.1 28.83,29.23 v29.39,28.68
  Bottom 0.406: v29.39,28.68 35.36,28.68 39.88,33.2 v39.88,34.29
VCC  (via drill 0.3)
  Top 0.203: IC4.37 39.43,44.29 v39.98,44.3 | IC4.62 43.8,38.48 43.79,38.48 | 38.91,40.69 IC4.46 | 49.12,42.9 49.31,43.09 IC4.86 | IC4.2 48.6,49.31 48.51,49.23 | IC4.16 43,49.26 43.08,49.17 | IC4.55 | 41,38.46 IC4.55
  Top 0.406: v47.57,42.93 arc90 47.6,42.9 49.12,42.9 | 43.79,38.48 43.79,38.67 42.11,40.34 41.62,40.34 v41.55,40.28 | 38.91,40.69 41.15,40.69 v41.55,40.28 | v47.3,49.1 48.39,49.1 48.51,49.23 | 43.08,49.17 43.61,48.87 v43.69,48.79 | 41,38.46 41,39.73 v41.55,40.28
  Bottom 0.254: 7.84,72.21 R1.2
  Bottom 0.406: IC5.16 62.37,60.2 C18.1 | IC2.8 26.02,75.59 25.55,75.59 25.5,75.54 | IC3.8 26.05,69.19 C11.1 | C13.1 39.1,40.32 | 41.62,40.34 v41.55,40.28 | 39.66,40.28 C13.1 | 43.64,40.4 C8.1 | C13.1 39.62,42.58 C14.1 39.69,44.03 v39.98,44.3 39.98,44.98 40.8,45.63 R2.2 | C17.1 47.57,44.67 | 47.23,47.35 arc-90 C16.1 47.3,47.41 | 4.62,72.21 5.13,72.21 12.09,79.17 18.11,79.17 18.41,78.87 | 4.62,72.21 X2.2 | 4.62,72.21 7.84,72.21
  Bottom 0.61: v47.3,49.1 46.35,49.1 46.35,48.79 v43.69,48.79 | 59.28,60.05 IC5.16
  Bottom 0.813: C8.1 41.62,40.34 | v41.55,40.28 39.66,40.28 | 43.64,40.4 C15.1 v47.57,42.93 47.57,44.67 | 47.23,47.35 C17.1 45.62,43.39 45.62,36.32 49.63,32.31 49.63,15.82 47.28,13.48 C19.1 R4.2 31.94,11.99 IC6.4 25.4,10.11 17.73,10.11 15.87,8.25 X3.2 | 47.3,47.41 v47.3,49.1 47.3,51.71 | 18.41,75.59 18.41,78.87 X5.3 | C10.1 26.02,75.59 18.41,75.59 | IC3.3 35.87,66.65 36.55,65.96 36.55,58.42 36.25,58.12 | 59.28,60.05 59.28,52.83 58.47,52.02 47.6,52.02 arc90 47.3,51.71 | 18.41,75.59 18.41,69.65 18.81,69.25 24.11,69.25 | 24.11,69.25 C11.1 | 24.11,69.25 24.31,69.05 24.31,65.86 24.94,65.23 24.94,58.9 25.73,58.12 36.25,58.12 | 36.25,58.12 46.41,58.12 47.3,57.23 47.3,51.71
VDC  (via drill 0.3)
  Top 0.813: X5.4 18.41,86.01 17.14,87.27 14.38,87.27 13.64,86.54 13.64,77.47 v13.61,77.44
  Bottom 0.61: 24.13,20.27 24.16,20.24 | 13.12,9.74 13.03,9.65 | 19.51,16.13 F1.2
  Bottom 0.813: C20.+ 29.58,21.09 29.58,20.24 | 29.58,20.24 IC6.3 | F1.2 22.07,20.27 24.13,20.27 | 24.16,20.24 29.58,20.24 | X3.3 16.7,3.02 13.95,3.02 13.03,3.94 13.03,9.65 | 19.51,16.13 13.12,9.74 11.89,8.51 5.03,8.51 4.12,9.42 4.12,65.13 5.84,66.85 11.58,66.85 13.61,68.89 v13.61,77.44
VDDCORE  (via drill 0.3)
  Top 0.203: IC4.85 49.8,42.69 49.2,42.09 v48.49,42.09
  Bottom 0.406: C7.1 49.23,40.31 49.07,40.56 49.07,41.5 v48.49,42.09
VPP  (via drill 0.3)
  Top 0.203: IC4.13 44.2,60.58 43.99,60.83
  Top 0.254: v43.79,60.83 43.99,60.83 | v38.89,60.86 34.01,60.86 31.27,63.6 29.31,65.56 21.11,65.56 v20.8,65.25 | v6.88,64.52 3.86,67.54 X2.1
  Bottom 0.254: v43.79,60.83 38.91,60.83 v38.89,60.86 | D1.C 3.91,69.72 X2.1 | v20.8,65.25 7.62,65.25 v6.88,64.52

### Text on the board
tNames: ICSP | ANALOG | RS-232 | USB | 32.768KHz | 24MHz | DC 6.5~9V